# EasyEDA schematic SCH_transistor-as-switch_2025-12-18.json
TITLE: Sheet_1; REV: 1.0; Date: 2025-12-18; Sheet: 1/1; Drawn By: thulasizwephetha23; Company: Your Company
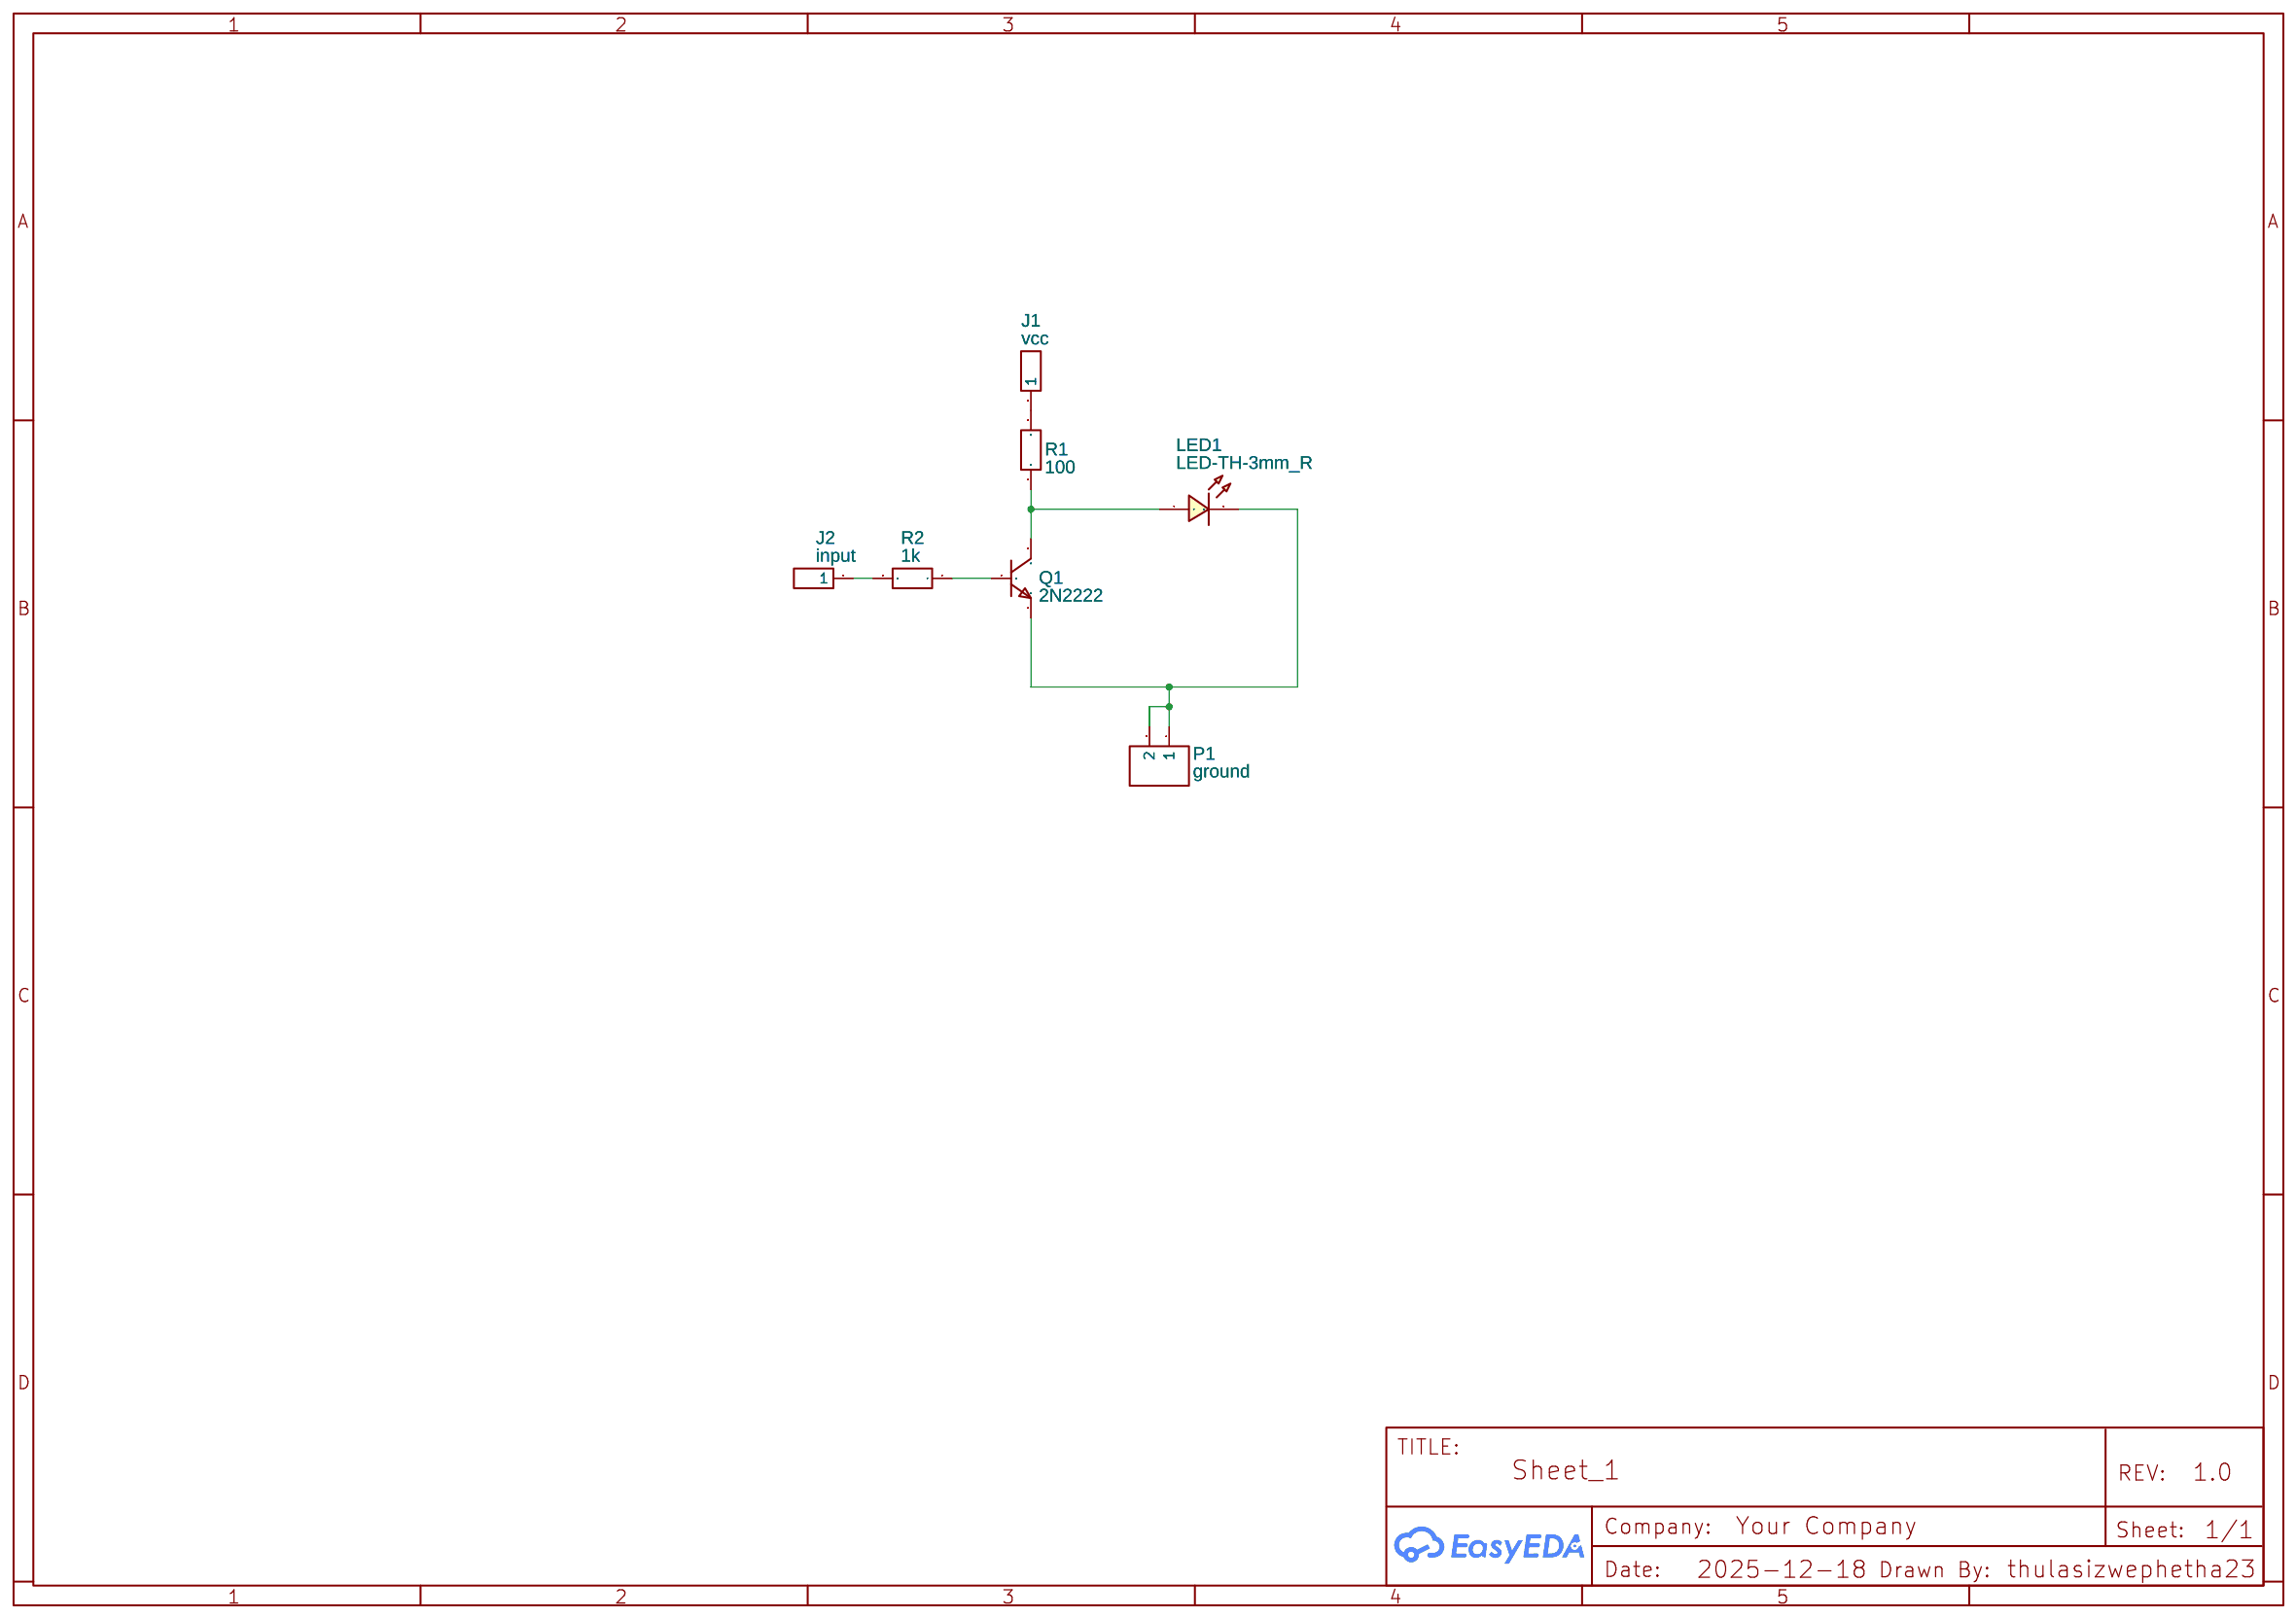
[diagram p0: schematic sheet]

## Parts
J1  vcc  [HDR-M-2.54_1X1]
J2  input  [HDR-M-2.54_1X1]
LED1  LED-TH-3mm_R  [LED-TH_BD3.0_RED]
P1  ground  [CONN-TH_2P-P5.00]
Q1  2N2222  [TO-92-3_L4.9-W3.7-P1.27-L]
R1  100  [R_AXIAL-0.3]
R2  1k  [R_AXIAL-0.3]

## Library data of the parts
J1 J2 = HDR-M-2.54_1x1: Supplier Part: C81276; Supplier: LCSC; Contributor: LCEDA_Lib
LED1 = LED-TH-3mm_R: Manufacturer: EVERLIGHT(台湾亿光); Manufacturer Part: 204-10SDRD/S530-A3-L; Supplier Part: C84774; Supplier: LCSC; Contributor: LCEDA_Lib
P1 = CONN-TH_2P-P5.00: Supplier: LCSC; Contributor: LCEDA_Lib
Q1 = 2N2222: Contributor: LCSC; Supplier: LCSC; Manufacturer: ST(先科); Manufacturer Part: 2N2222A; Supplier Part: C118536; JLCPCB Part Class: Extended Part
R1 R2 = R_AXIAL-0.3_EU: Contributor: LCEDA_Lib

## Nets
Net-(J1-1): J1.1 R1.2
Net-(J2-1): J2.1 R2.2
Net-(LED1-1): LED1.1 Q1.3(C) R1.1
Net-(LED1-2): LED1.2 P1.1 P1.2 Q1.1(E)
Net-(Q1-2): Q1.2(B) R2.1
